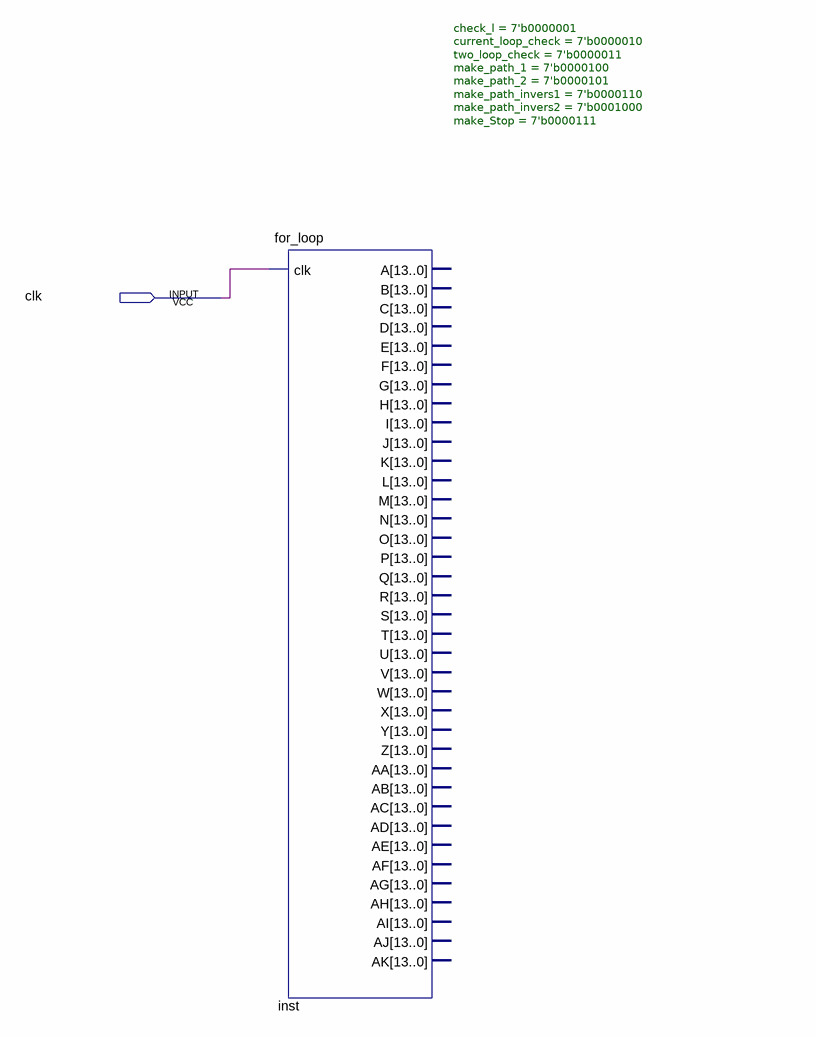
[diagram p0: schematic sheet]
// Quartus schematic f_b.bdf as structural Verilog: 1 symbols, 1 pins
module f_b (
  input  clk
);

  for_loop #(.check_l(7'b0000001), .current_loop_check(7'b0000010), .two_loop_check(7'b0000011), .make_path_1(7'b0000100), .make_path_2(7'b0000101), .make_path_invers1(7'b0000110), .make_path_invers2(7'b0001000), .make_Stop(7'b0000111)) inst (.clk(clk));  // open: A, B, C, D, E, F, G, H, I, J, K, L, M, N, O, P, Q, R, S, T, U, V, W, X, Y, Z, AA, AB, AC, AD, AE, AF, AG, AH, AI, AJ, AK
endmodule
